# Altium schematic sheet Main.SchDoc
size 381 x 241 mm; SheetNumber: 1; SheetTotal: 19
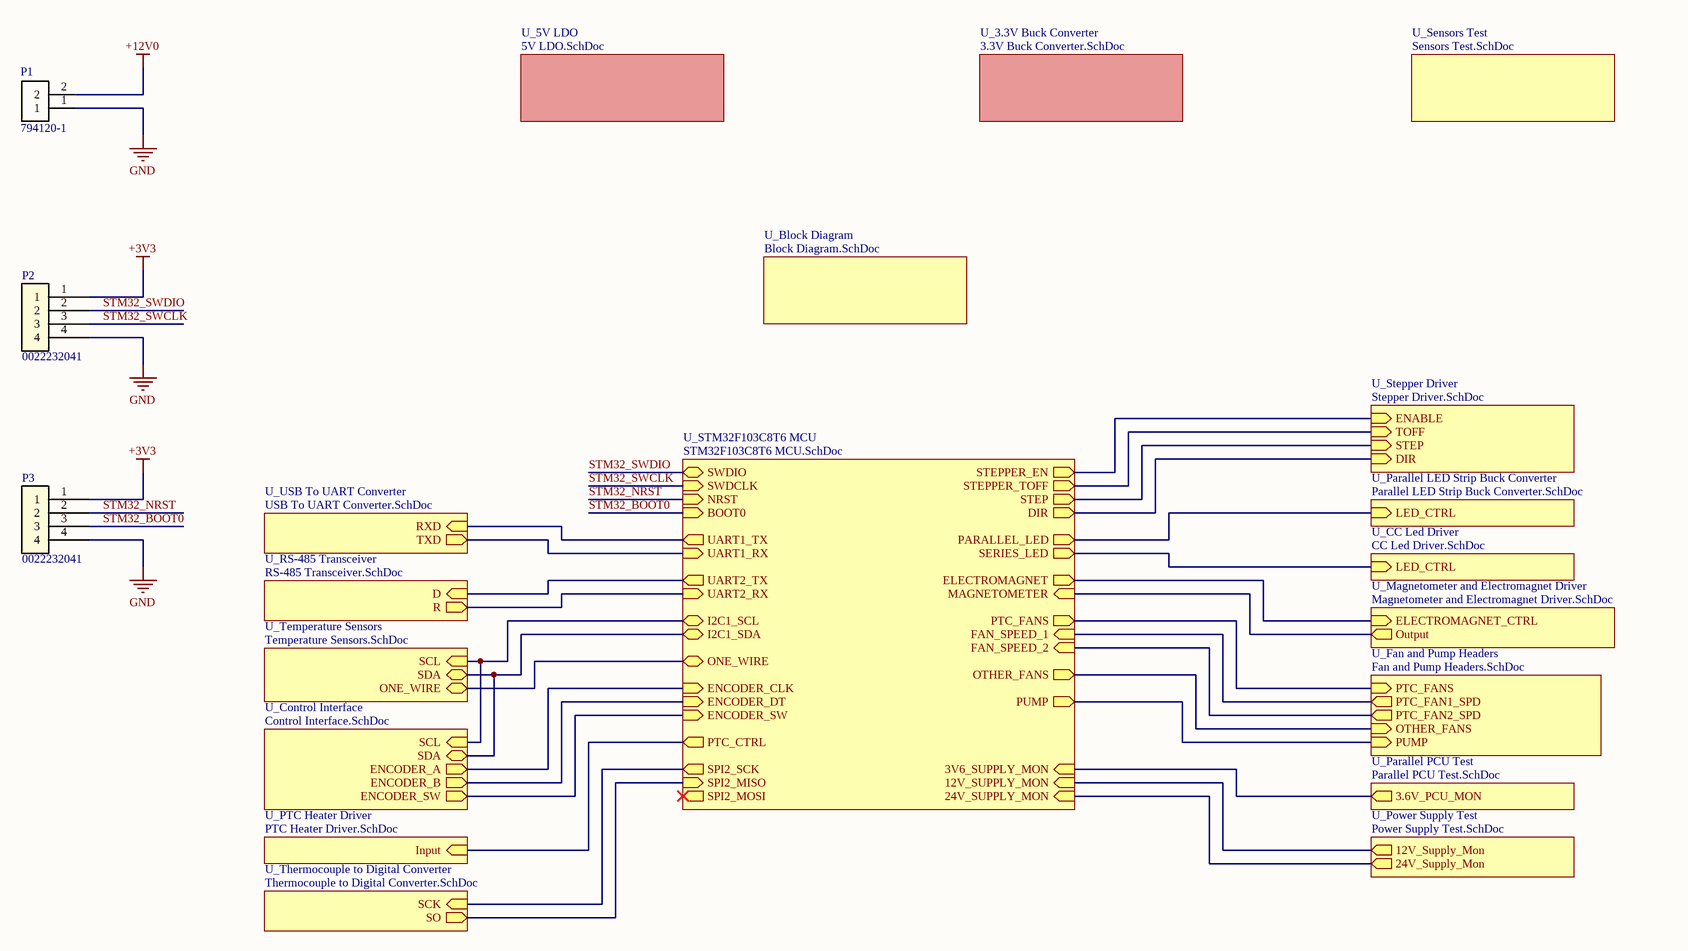
[diagram p0: Main.SchDoc]

## Parts
P1  794120-1  [POWER2-5.08 right angle]
P2  0022232041  [Signal4]
P3  0022232041  [Signal4]

## Sub-sheets
U_3.3V Buck Converter = 3.3V Buck Converter.SchDoc: no entries
U_5V LDO = 5V LDO.SchDoc: no entries
U_Block Diagram = Block Diagram.SchDoc: no entries
U_CC Led Driver = CC Led Driver.SchDoc: LED_CTRL (in)
U_Control Interface = Control Interface.SchDoc: SCL (in), SDA (bidir), ENCODER_A (out), ENCODER_B (out), ENCODER_SW (out)
U_Fan and Pump Headers = Fan and Pump Headers.SchDoc: PTC_FAN1_SPD (out), PTC_FAN2_SPD (out), PTC_FANS (in), OTHER_FANS (in), PUMP (in)
U_Magnetometer and Electromagnet Driver = Magnetometer and Electromagnet Driver.SchDoc: Output (out), ELECTROMAGNET_CTRL (in)
U_Parallel LED Strip Buck Converter = Parallel LED Strip Buck Converter.SchDoc: LED_CTRL (in)
U_Parallel PCU Test = Parallel PCU Test.SchDoc: 3.6V_PCU_MON (out)
U_Power Supply Test = Power Supply Test.SchDoc: 12V_Supply_Mon (out), 24V_Supply_Mon (out)
U_PTC Heater Driver = PTC Heater Driver.SchDoc: Input (in)
U_RS-485 Transceiver = RS-485 Transceiver.SchDoc: R (out), D (in)
U_Sensors Test = Sensors Test.SchDoc: no entries
U_Stepper Driver = Stepper Driver.SchDoc: ENABLE (in), STEP (in), DIR (in), TOFF (in)
U_STM32F103C8T6 MCU = STM32F103C8T6 MCU.SchDoc: SWDIO (bidir), SWDCLK (in), NRST (in), BOOT0 (in), UART1_TX (out), UART2_TX (out), UART1_RX (in), UART2_RX (in), STEP (out), DIR (out), STEPPER_EN (out), STEPPER_TOFF (out), I2C1_SDA (bidir), I2C1_SCL (bidir), 12V_SUPPLY_MON (in), 24V_SUPPLY_MON (in), 3V6_SUPPLY_MON (in), ONE_WIRE (bidir), MAGNETOMETER (in), SPI2_SCK (out), SPI2_MOSI (out), SPI2_MISO (in), PARALLEL_LED (out), SERIES_LED (out), ELECTROMAGNET (out), PTC_FANS (out), PUMP (out), FAN_SPEED_1 (in), FAN_SPEED_2 (in), ENCODER_CLK (in), ENCODER_DT (in), ENCODER_SW (in), OTHER_FANS (out), PTC_CTRL (out)
U_Temperature Sensors = Temperature Sensors.SchDoc: SCL (in), SDA (bidir), ONE_WIRE (bidir)
U_Thermocouple to Digital Converter = Thermocouple to Digital Converter.SchDoc: SCK (in), SO (out)
U_USB To UART Converter = USB To UART Converter.SchDoc: RXD (in), TXD (out)

## Nets
+3V3: P2.1 P3.1
+12V0: P1.2
GND: P1.1 P2.4 P3.4
STM32_BOOT0: P3.3 ; sheet U_STM32F103C8T6 MCU/BOOT0
STM32_NRST: P3.2 ; sheet U_STM32F103C8T6 MCU/NRST
STM32_SWCLK: P2.3 ; sheet U_STM32F103C8T6 MCU/SWDCLK
STM32_SWDIO: P2.2 ; sheet U_STM32F103C8T6 MCU/SWDIO
(unnamed): sheet U_CC Led Driver/LED_CTRL, sheet U_STM32F103C8T6 MCU/SERIES_LED
(unnamed): sheet U_Control Interface/SCL, sheet U_STM32F103C8T6 MCU/I2C1_SCL, sheet U_Temperature Sensors/SCL
(unnamed): sheet U_Control Interface/SDA, sheet U_STM32F103C8T6 MCU/I2C1_SDA, sheet U_Temperature Sensors/SDA
(unnamed): sheet U_Control Interface/ENCODER_A, sheet U_STM32F103C8T6 MCU/ENCODER_CLK
(unnamed): sheet U_Control Interface/ENCODER_B, sheet U_STM32F103C8T6 MCU/ENCODER_DT
(unnamed): sheet U_Control Interface/ENCODER_SW, sheet U_STM32F103C8T6 MCU/ENCODER_SW
(unnamed): sheet U_Fan and Pump Headers/PTC_FAN1_SPD, sheet U_STM32F103C8T6 MCU/FAN_SPEED_1
(unnamed): sheet U_Fan and Pump Headers/PTC_FAN2_SPD, sheet U_STM32F103C8T6 MCU/FAN_SPEED_2
(unnamed): sheet U_Fan and Pump Headers/PTC_FANS, sheet U_STM32F103C8T6 MCU/PTC_FANS
(unnamed): sheet U_Fan and Pump Headers/OTHER_FANS, sheet U_STM32F103C8T6 MCU/OTHER_FANS
(unnamed): sheet U_Fan and Pump Headers/PUMP, sheet U_STM32F103C8T6 MCU/PUMP
(unnamed): sheet U_Magnetometer and Electromagnet Driver/Output, sheet U_STM32F103C8T6 MCU/MAGNETOMETER
(unnamed): sheet U_Magnetometer and Electromagnet Driver/ELECTROMAGNET_CTRL, sheet U_STM32F103C8T6 MCU/ELECTROMAGNET
(unnamed): sheet U_Parallel LED Strip Buck Converter/LED_CTRL, sheet U_STM32F103C8T6 MCU/PARALLEL_LED
(unnamed): sheet U_Parallel PCU Test/3.6V_PCU_MON, sheet U_STM32F103C8T6 MCU/3V6_SUPPLY_MON
(unnamed): sheet U_Power Supply Test/12V_Supply_Mon, sheet U_STM32F103C8T6 MCU/12V_SUPPLY_MON
(unnamed): sheet U_Power Supply Test/24V_Supply_Mon, sheet U_STM32F103C8T6 MCU/24V_SUPPLY_MON
(unnamed): sheet U_PTC Heater Driver/Input, sheet U_STM32F103C8T6 MCU/PTC_CTRL
(unnamed): sheet U_RS-485 Transceiver/R, sheet U_STM32F103C8T6 MCU/UART2_RX
(unnamed): sheet U_RS-485 Transceiver/D, sheet U_STM32F103C8T6 MCU/UART2_TX
(unnamed): sheet U_Stepper Driver/ENABLE, sheet U_STM32F103C8T6 MCU/STEPPER_EN
(unnamed): sheet U_Stepper Driver/STEP, sheet U_STM32F103C8T6 MCU/STEP
(unnamed): sheet U_Stepper Driver/DIR, sheet U_STM32F103C8T6 MCU/DIR
(unnamed): sheet U_Stepper Driver/TOFF, sheet U_STM32F103C8T6 MCU/STEPPER_TOFF
(unnamed): sheet U_STM32F103C8T6 MCU/UART1_TX, sheet U_USB To UART Converter/RXD
(unnamed): sheet U_STM32F103C8T6 MCU/UART1_RX, sheet U_USB To UART Converter/TXD
(unnamed): sheet U_STM32F103C8T6 MCU/ONE_WIRE, sheet U_Temperature Sensors/ONE_WIRE
(unnamed): sheet U_STM32F103C8T6 MCU/SPI2_SCK, sheet U_Thermocouple to Digital Converter/SCK
(unnamed): sheet U_STM32F103C8T6 MCU/SPI2_MISO, sheet U_Thermocouple to Digital Converter/SO

## Notes on the sheet
- Project:
- Sheet Title:
- Size
- Date:
- A
- Sheet Number:
- Sheet Total:
- Revision:
- Time:
- Author:

## Library data of the parts
P1 = Power2: PCB Mount Header, Right Angle, Wire-to-Board, 2 Position, 5.08 mm [.2 in] Centerline, Fully Shrouded, Pre-Tin, Commercial MATE-N-LOK; MP: TE Connectivity; MF: 794120-1; ComponentLink1Description: Datasheet; ComponentLink1URL: https://www.te.com/commerce/DocumentDelivery/DDEController?Action=srchrtrv&DocNm=114-1012&DocType=Specification%20Or%20Standard&DocLang=English&DocFormat=pdf&PartCntxt=794120-1; ComponentLink2Description: Supplier1
P2 P3 = Signal4: SignalConnector, 4 leads; MF: Molex; ComponentLink1Description: Datasheet; ComponentLink1URL: https://tools.molex.com/pdm_docs/ps/PS-10-07-001.pdf; ComponentLink2Description: Supplier1; ComponentLink2URL: https://www.digikey.com/en/products/detail/molex/0022232041/26671; MP: 0022232041